# EAGLE schematic EtherTenR3 (EAGLE 6.2)
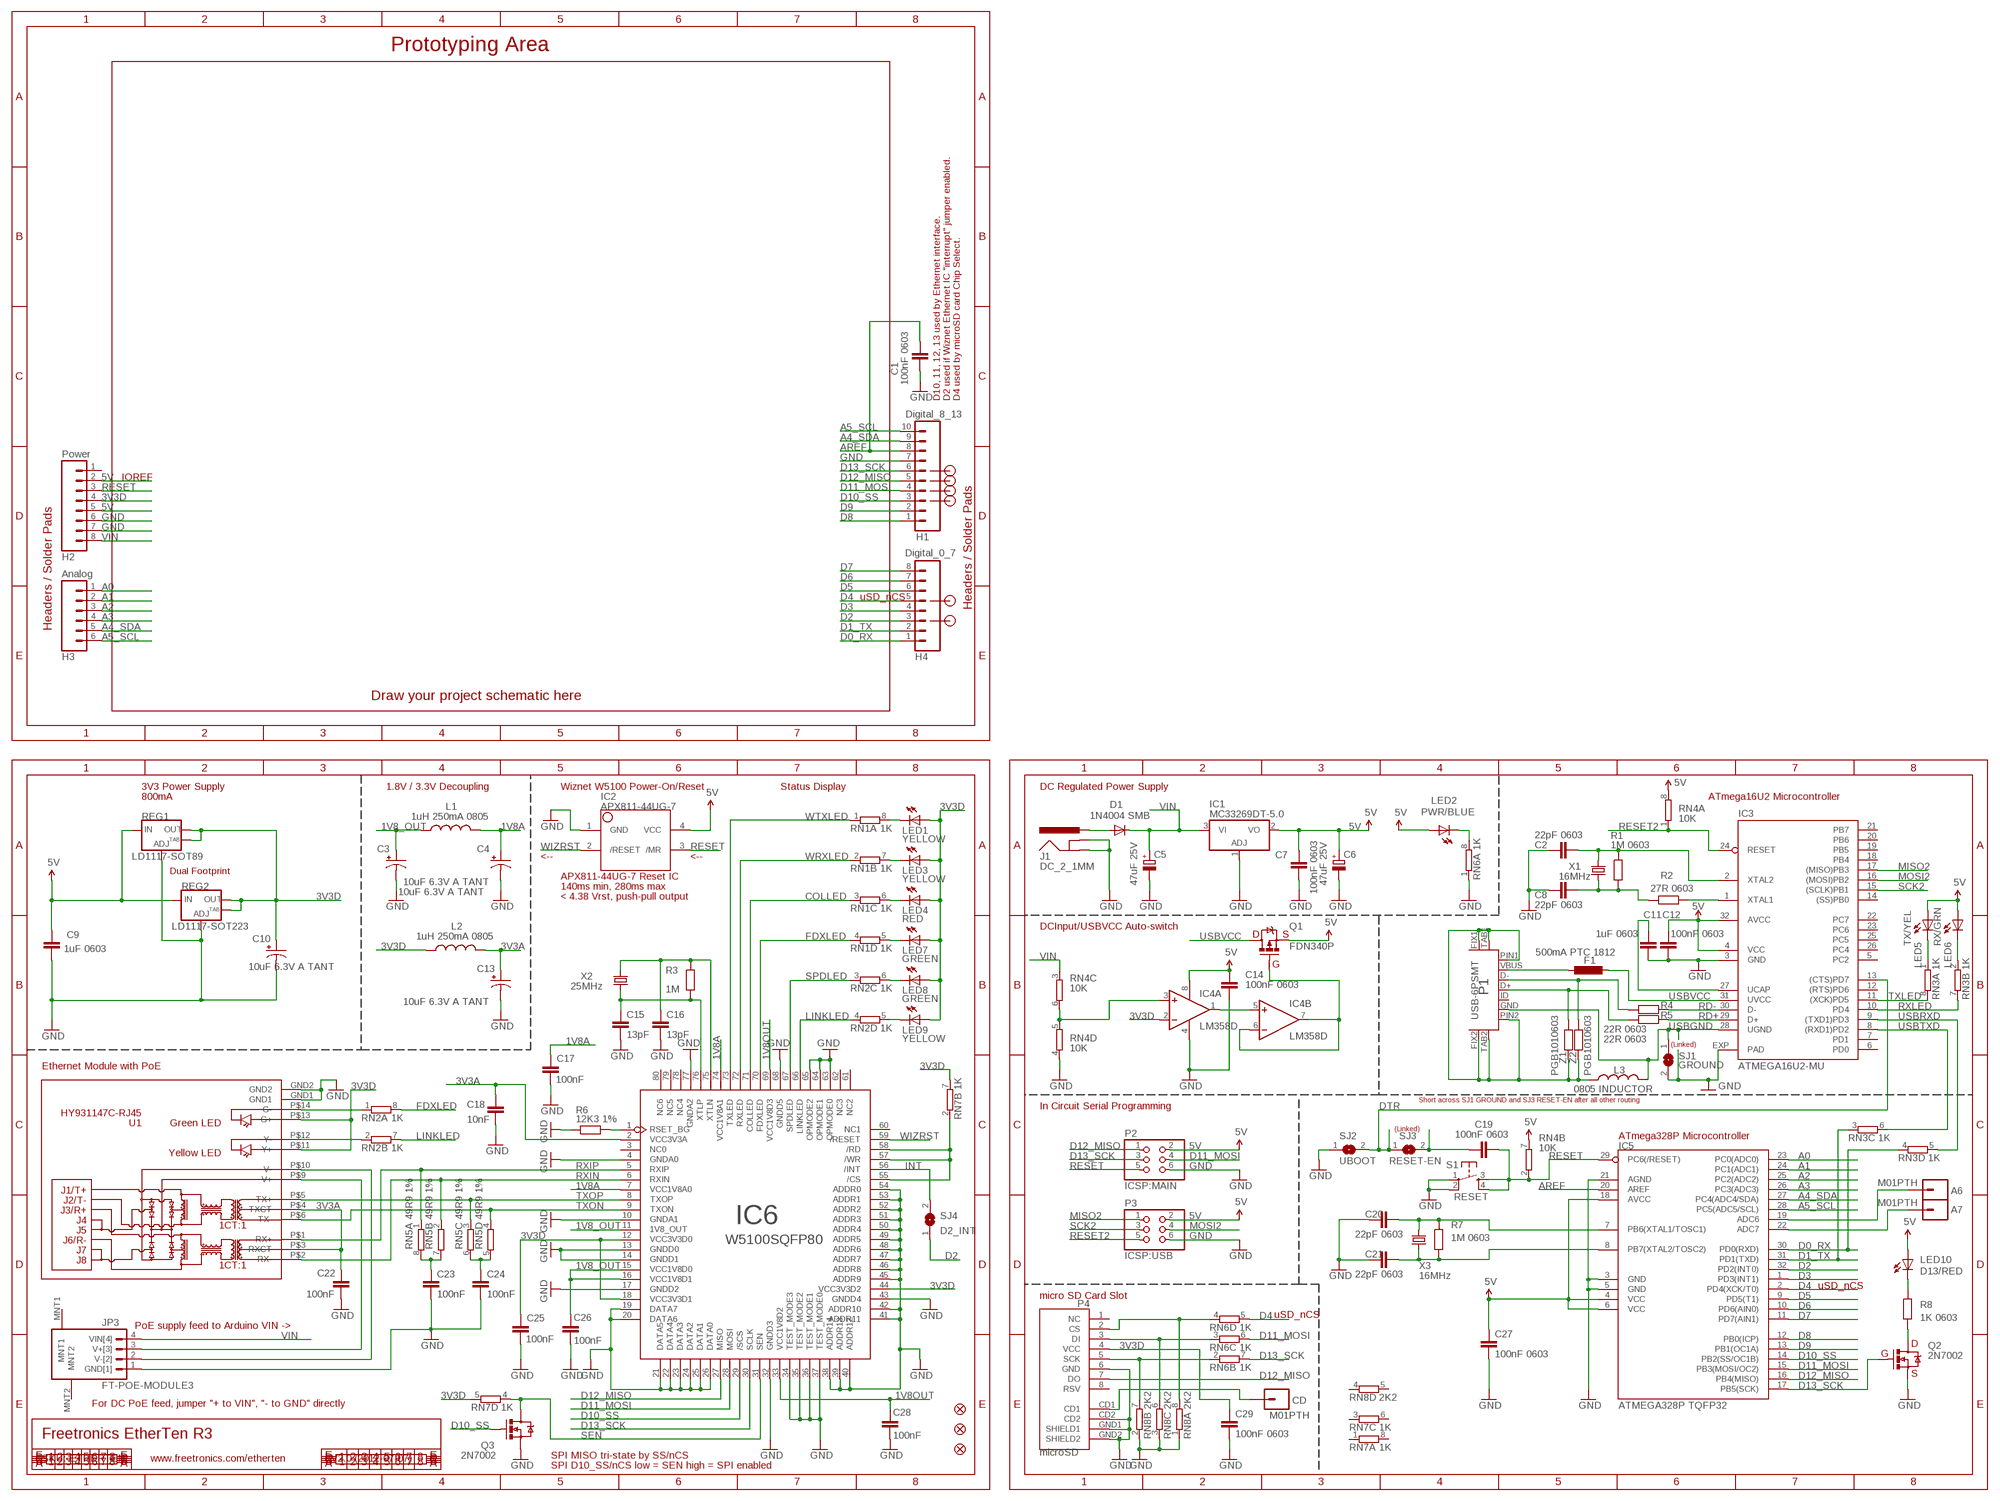
[diagram p0: schematic, sheet 1]

## Parts
A6  M01PTH  [1X01]
A7  M01PTH  [1X01]
C1  100nF 0603  CAP0603  [0603]
C2  22pF 0603  CAP0603  [0603]
C3  10uF 6.3V A TANT  CAP_POL1206  [EIA3216]
C4  10uF 6.3V A TANT  CAP_POL1206  [EIA3216]
C5  47uF 25V  CPOL-EUD  [PANASONIC_D]
C6  47uF 25V  CPOL-EUD  [PANASONIC_D]
C7  100nF 0603  CAP0603  [0603]
C8  22pF 0603  CAP0603  [0603]
C9  1uF 0603  CAP0603  [0603]
C10  10uF 6.3V A TANT  CAP_POL1206  [EIA3216]
C11  1uF 0603  CAP0603  [0603]
C12  100nF 0603  CAP0603  [0603]
C13  10uF 6.3V A TANT  CAP_POL1206  [EIA3216]
C14  100nF 0603  CAP0603  [0603]
C15  13pF  CAP0603  [0603]
C16  13pF  CAP0603  [0603]
C17  100nF  CAP0603  [0603]
C18  10nF  CAP0603  [0603]
C19  100nF 0603  CAP0603  [0603]
C20  22pF 0603  CAP0603  [0603]
C21  22pF 0603  CAP0603  [0603]
C22  100nF  CAP0603  [0603]
C23  100nF  CAP0603  [0603]
C24  100nF  CAP0603  [0603]
C25  100nF  CAP0603  [0603]
C26  100nF  CAP0603  [0603]
C27  100nF 0603  CAP0603  [0603]
C28  100nF  CAP0603  [0603]
C29  100nF 0603  CAP0603  [0603]
CD  M01PTH  [1X01]
D1  1N4004 SMB  DIODESMB  [SMB-DIODE]
F1  500mA PTC 1812  L-EUL1812  [L1812]
FID1  FIDUCIAL1X2.5  [FIDUCIAL-1X2.5]
FID2  FIDUCIAL1X2.5  [FIDUCIAL-1X2.5]
FID3  FIDUCIAL1X2.5  [FIDUCIAL-1X2.5]
H1  Digital_8_13  M100.1  [1X10]
H2  Power  M08  [1X08]
H3  Analog  M06SIP  [1X06]
H4  Digital_0_7  M08  [1X08]
IC1  MC33269DT-5.0  MC33269D-5.0  [DPACK]
IC2  APX811-44UG-7  APX81X-RESET-IC  [SOT143-R]
IC3  ATMEGA16U2-MU  ATMEL_ATMEGA8U2-MUQFN  [ATMEL_QFN32]
IC4  LM358D  [SO08]
IC5  ATMEGA328P TQFP32  AVR-MEGA8-AI  [TQFP32-08]
IC6  W5100SQFP80  [SQFP80]
J1  DC_2_1MM  POWER_JACKPTH  [POWER_JACK_PTH]
JP3  FT-POE-MODULE3  [FT-POE-MODULE-NOLABEL]
L1  1uH 250mA 0805  L-USL2012C  [L2012C]
L2  1uH 250mA 0805  L-USL2012C  [L2012C]
L3  0805 INDUCTOR  INDUCTOR0805-LARGE  [0805-LARGE]
LED1  YELLOW  LED0603  [LED-0603]
LED2  PWR/BLUE  LED0603  [LED-0603]
LED3  YELLOW  LED0603  [LED-0603]
LED4  RED  LED0603  [LED-0603]
LED5  TX/YEL  LED0603  [LED-0603]
LED6  RX/GRN  LED0603  [LED-0603]
LED7  GREEN  LED0603  [LED-0603]
LED8  GREEN  LED0603  [LED-0603]
LED9  YELLOW  LED0603  [LED-0603]
LED10  D13/RED  LED0603  [LED-0603]
P1  USB-6PSMT  [USB-MICROB-MB05PMXX]
P2  ICSP:MAIN  PINHD-2X3  [2X03]
P3  ICSP:USB  PINHD-2X3  [2X03]
P4  microSD  USD-SOCKETNEW  [MICRO-SD-SOCKET-PP]
Q1  FDN340P  MOSFET-PCHANNEL  [SOT23]
Q2  2N7002  MOSFET-NCHANNELSMD  [SOT23-3]
Q3  2N7002  MOSFET-NCHANNELSMD  [SOT23-3]
R1  1M 0603  RESISTOR0603  [0603]
R2  27R 0603  RESISTOR0603  [0603]
R3  1M  RESISTOR0603  [0603]
R4  22R 0603  RESISTOR0603  [0603]
R5  22R 0603  RESISTOR0603  [0603]
R6  12K3 1%  RESISTOR0603  [0603]
R7  1M 0603  RESISTOR0603  [0603]
R8  1K 0603  RESISTOR0603  [0603]
REG1  LD1117-SOT89  V_REG_LM1117SOT89  [SOT89]
REG2  LD1117-SOT223  V_REG_LM1117SOT223  [SOT223]
RN1  1K  4R-NCAY16  [CAY16]
RN2  1K  4R-NCAY16  [CAY16]
RN3  1K  4R-NCAY16  [CAY16]
RN4  10K  4R-NCAY16  [CAY16]
RN5  49R9 1%  4R-NCAY16  [CAY16]
RN6  1K  4R-NCAY16  [CAY16]
RN7  1K  4R-NCAY16  [CAY16]
RN8  2K2  4R-NCAY16  [CAY16]
S1  RESET  TAC_SWITCHSMD  [TACTILE_SWITCH_SMD]
SJ1  GROUND  SJ  [SJ]
SJ2  UBOOT  SJ  [SJ]
SJ3  RESET-EN  SJ  [SJ]
SJ4  D2_INT  SJ  [SJ]
U1  HY931147C-RJ45  [HY931147C]
X1  16MHz  CRYSTALHC49UV  [HC49U-V]
X2  25MHz  CRYSTALHC49UV  [HC49U-V]
X3  16MHz  CRYSTALHC49UV  [HC49U-V]
Z1  PGB1010603  RESISTOR0603  [0603]
Z2  PGB1010603  RESISTOR0603  [0603]

## Nets
1V8_OUT: C3.A(+) C26.1 IC6.11(1V8_OUT) IC6.15(VCC1V8D0) IC6.16(VCC1V8D1) L1.1
1V8A: C4.A(+) C17.1 IC6.7(VCC1V8A0) IC6.74(VCC1V8A1) L1.2
1V8OUT: C28.1 IC6.33(VCC1V8D2) IC6.69(VCC1V8D3)
3V3A: C13.A(+) C18.1 C22.1 IC6.2(VCC3V3A) L2.2 U1.P$3(RXCT) U1.P$4(TXCT)
3V3D: C10.A(+) C25.1 C29.1 H2.4 IC4.2(A:-IN) IC6.12(VCC3V3D0) IC6.18(VCC3V3D1) IC6.44(VCC3V3D2) L2.1 LED1.A LED3.A LED4.A LED7.A LED8.A LED9.A P4.4(VCC) REG1.2(OUT) REG1.4(OUT) REG2.2(OUT) REG2.4(OUT) RN7.5 RN7.7 U1.P$11(Y+) U1.P$13(G+)
5V [power]: C6.+ C7.1 C9.1 C12.1 C14.1 C27.1 H2.2 H2.5 IC1.2(VO) IC2.4(VCC) IC3.4(VCC) IC3.32(AVCC) IC4.8(P:V+) IC5.4(VCC) IC5.6(VCC) IC5.18(AVCC) LED2.A LED5.A LED6.A LED10.A P2.2 P3.2 Q1.2(S) REG1.3(IN) REG2.3(IN) RN4.7 RN4.8
A0: H3.1 IC5.23(PC0(ADC0))
A1: H3.2 IC5.24(PC1(ADC1))
A2: H3.3 IC5.25(PC2(ADC2))
A3: H3.4 IC5.26(PC3(ADC3))
A4_SDA: H1.9 H3.5 IC5.27(PC4(ADC4/SDA))
A5_SCL: H1.10 H3.6 IC5.28(PC5(ADC5/SCL))
AREF: C1.1 H1.8 IC5.20(AREF)
COLLED: IC6.71(COLLED) RN1.3
D0_RX: H4.1 IC5.30(PD0(RXD)) RN3.4
D1_TX: H4.2 IC5.31(PD1(TXD)) RN3.3
D2: H4.3 IC5.32(PD2(INT0)) SJ4.1
D3: H4.4 IC5.1(PD3(INT1))
D4: H4.5 IC5.2(PD4(XCK/T0)) RN6.5
D5: H4.6 IC5.9(PD5(T1))
D6: H4.7 IC5.10(PD6(AIN0))
D7: H4.8 IC5.11(PD7(AIN1))
D8: H1.1 IC5.12(PB0(ICP))
D9: H1.2 IC5.13(PB1(OC1A))
D10_SS: H1.3 IC5.14(PB2(SS/OC1B)) IC6.29(/SCS) Q3.1(G)
D11_MOSI: H1.4 IC5.15(PB3(MOSI/OC2)) IC6.28(MOSI) P2.4 RN6.6
D12_MISO: H1.5 IC5.16(PB4(MISO)) IC6.27(MISO) P2.1 P4.7(DO)
D13_SCK: H1.6 IC5.17(PB5(SCK)) IC6.30(SCLK) P2.3 Q2.1(G) RN6.7
DTR: IC3.13((CTS)PD7) SJ2.2 SJ3.1
FDXLED: IC6.70(FDXLED) RN1.4 RN2.8
GND: C1.2 C2.1 C3.C(-) C4.C(-) C5.- C6.- C7.2 C8.1 C9.2 C10.C(-) C11.2 C12.2 C13.C(-) C14.2 C15.2 C16.2 C17.2 C18.2 C20.1 C21.1 C22.2 C23.2 C24.2 C25.2 C26.2 C27.2 C28.2 C29.2 H1.7 H2.6 H2.7 IC1.1(ADJ) IC2.1(GND) IC3.3(GND) IC3.EXP(PAD) IC4.4(P:V-) IC5.3(GND) IC5.5(GND) IC5.21(AGND) IC6.4(GNDA0) IC6.10(GNDA1) IC6.13(GNDD0) IC6.14(GNDD1) IC6.17(GNDD2) IC6.19(DATA7) IC6.20(DATA6) IC6.21(DATA5) IC6.22(DATA4) IC6.23(DATA3) IC6.24(DATA2) IC6.25(DATA1) IC6.26(DATA0) IC6.32(GNDD3) IC6.34(TEST_MODE3) IC6.35(TEST_MODE2) IC6.36(TEST_MODE1) IC6.37(TEST_MODE0) IC6.38(ADDR14) IC6.39(ADDR13) IC6.40(ADDR12) IC6.41(ADDR11) IC6.42(ADDR10) IC6.43(GNDD4) IC6.45(ADDR9) IC6.46(ADDR8) IC6.47(ADDR7) IC6.48(ADDR6) IC6.49(ADDR5) IC6.50(ADDR4) IC6.51(ADDR3) IC6.52(ADDR2) IC6.53(ADDR1) IC6.54(ADDR0) IC6.63(OPMODE0) IC6.64(OPMODE1) IC6.65(OPMODE2) IC6.68(GNDD5) IC6.77(GNDA2) J1.GND J1.GNDBREAK JP3.1(GND[1]) P2.6 P3.6 P4.6(GND) P4.CD2 P4.GND1(SHIELD1) P4.GND2(SHIELD2) Q2.2(S) Q3.2(S) R6.1 REG1.1(ADJ) REG2.1(ADJ) RN4.4 RN6.1 RN8.1 RN8.2 RN8.3 S1.1 S1.2 SJ1.2 SJ2.1 U1.GND1 U1.GND2
INT: IC6.56(/INT) SJ4.2
LINKLED: IC6.66(LINKLED) RN2.4 RN2.7
MISO2: IC3.17((MISO)PB3) P3.1
MOSI2: IC3.16((MOSI)PB2) P3.4
N$1: C24.1 RN5.5 RN5.6
N$2: C20.2 IC5.7(PB6(XTAL1/TOSC1)) R7.2 X3.2
N$3: C19.1 SJ3.2
N$4: LED10.C R8.2
N$6: Q2.3(D) R8.1
N$7: C21.2 IC5.8(PB7(XTAL2/TOSC2)) R7.1 X3.1
N$8: IC3.1(XTAL1) R2.1
N$9: L3.1 P1.FIX1 P1.FIX2 P1.PIN1 P1.PIN2 P1.TAB1 P1.TAB2 Z1.2 Z2.2
N$11: LED6.C RN3.2
N$12: IC4.3(A:+IN) RN4.5 RN4.6
N$13: LED5.C RN3.1
N$14: LED2.C RN6.8
N$16: P1.D+ R5.2 Z1.1
N$17: P1.D- R4.2 Z2.1
N$18: IC4.6(B:-IN) IC4.7(B:OUT) Q1.1(G)
N$19: IC4.1(A:OUT) IC4.5(B:+IN)
N$20: P4.2(CS) RN6.4 RN8.8
N$21: A7.1 IC5.22(ADC7)
N$22: A6.1 IC5.19(ADC6)
N$23: CD.1 P4.CD1
N$24: P4.5(SCK) RN6.2 RN8.7
N$25: P4.3(DI) RN6.3 RN8.6
N$26: LED8.C RN2.6
N$27: IC6.55(/CS) IC6.57(/WR) IC6.58(/RD) RN7.2
N$28: LED9.C RN2.5
N$60: D1.A J1.PWR
N$67: RN2.1 U1.P$14(G-)
N$68: JP3.3(V+[3]) U1.P$9(V+)
N$69: JP3.2(V-[2]) U1.P$10(V-)
N$113: C2.2 IC3.2(XTAL2) R1.2 X1.2
N$114: C8.2 R1.1 R2.2 X1.1
N$115: F1.1 P1.VBUS
N$117: C11.1 IC3.27(UCAP)
N$321: C23.1 RN5.7 RN5.8
N$322: IC6.1(RSET_BG) R6.2
N$327: LED7.C RN1.5
N$328: LED4.C RN1.6
N$329: LED3.C RN1.7
N$330: LED1.C RN1.8
N$332: RN2.2 U1.P$12(Y-)
RD+: IC3.29(D+) R5.1
RD-: IC3.30(D-) R4.1
RESET: C19.2 H2.3 IC2.3(/MR) IC5.29(PC6(/RESET)) P2.5 RN4.2 S1.3 S1.4
RESET2: IC3.24(RESET) P3.5 RN4.1
RXIN: IC6.6(RXIN) RN5.2 U1.P$2(RX-)
RXIP: IC6.5(RXIP) RN5.1 U1.P$1(RX+)
RXLED: IC3.10(PD4) RN3.7
SCK2: IC3.15((SCLK)PB1) P3.3
SEN: IC6.31(SEN) Q3.3(D) RN7.4
SPDLED: IC6.67(SPDLED) RN2.3
TXLED: IC3.11((XCK)PD5) RN3.8
TXON: IC6.9(TXON) RN5.4 U1.P$6(TX-)
TXOP: IC6.8(TXOP) RN5.3 U1.P$5(TX+)
USBGND: IC3.28(UGND) L3.2 P1.GND SJ1.1
USBRXD: IC3.9((TXD1)PD3) RN3.5
USBTXD: IC3.8((RXD1)PD2) RN3.6
USBVCC: F1.2 IC3.31(UVCC) Q1.3(D)
VIN: C5.+ D1.C H2.8 IC1.3(VI) JP3.4(VIN[4]) RN4.3
WIZRST: IC2.2(/RESET) IC6.59(/RESET)
WRXLED: IC6.72(RXLED) RN1.2
WTXLED: IC6.73(TXLED) RN1.1
XTLN: C16.1 IC6.75(XTLN) R3.2 X2.2
XTLP: C15.1 IC6.76(XTLP) R3.1 X2.1
Unconnected: H2.1 IC3.5(PC2) IC3.6(PD0) IC3.7(PD1) IC3.12((RTS)PD6) IC3.14((SS)PB0) IC3.18(PB4) IC3.19(PB5) IC3.20(PB6) IC3.21(PB7) IC3.22(PC7) IC3.23(PC6) IC3.25(PC5) IC3.26(PC4) IC6.3(NC0) IC6.60(NC1) IC6.61(NC2) IC6.62(NC3) IC6.78(NC4) IC6.79(NC5) IC6.80(NC6) JP3.MNT1 JP3.MNT2 P1.ID P4.1(NC) P4.8(RSV) RN7.1 RN7.3 RN7.6 RN7.8 RN8.4 RN8.5

## Notes on the sheet
- Prototyping Area
- D10, 11, 12, 13 used by Ethernet interface. | D2 used if Wiznet Ethernet IC "interrupt" jumper enabled. | D4 used by microSD card Chip Select.
- IOREF
- uSD_nCS
- Headers / Solder Pads
- Headers / Solder Pads
- Draw your project schematic here
- 3V3 Power Supply | 1.8V / 3.3V Decoupling | Wiznet W5100 Power-On/Reset | Status Display | DC Regulated Power Supply
- 800mA | ATmega16U2 Microcontroller
- <-- | <--
- Dual Footprint
- APX811-44UG-7 Reset IC
- 140ms min, 280ms max
- < 4.38 Vrst, push-pull output
- DCInput/USBVCC Auto-switch
- D | S
- G
- (Linked)
- Ethernet Module with PoE
- Short across SJ1 GROUND and SJ3 RESET-EN after all other routing
- In Circuit Serial Programming
- (Linked)
- ATmega328P Microcontroller
- uSD_nCS
- micro SD Card Slot
- uSD_nCS
- PoE supply feed to Arduino VIN ->
- D
- G
- S
- For DC PoE feed, jumper "+ to VIN", "- to GND" directly
- Freetronics EtherTen R3
- SPI MISO tri-state by SS/nCS
- SKU: ETHERTEN | www.freetronics.com/etherten | V2.0 (2012-07-07)
- SPI D10_SS/nCS low = SEN high = SPI enabled

## Library data of the parts
A6 A7 CD = freetronics-2:M01: Header 1 Standard 1-pin 0.1" header. Use with straight break away headers (SKU : PRT-00116), right angle break away headers (PRT-00553), swiss pins (PRT-00743), machine pins (PRT-00117), and female headers (PRT-00115).
C1 C2 C7-C9 C11 C12 C14-C29 = freetronics:CAP: Capacitor Standard 0603 ceramic capacitor, and 0.1" leaded capacitor.
C3 C4 C10 C13 = freetronics:CAP_POL: Capacitor Polarized These are standard SMD and PTH capacitors. Normally 10uF, 47uF, and 100uF in electrolytic and tantalum varieties. Always verify the external diameter of the through hole cap, it varies with capacity, voltage, and manufacturer. The EIA devices should be standard.
C5 C6 = rcl:CPOL-EU: POLARIZED CAPACITOR, European symbol
D1 = freetronics:DIODE: Diode These are standard reverse protection diodes and small signal diodes. SMA package can handle up to about 1A. SOD-323 can handle about 200mA. What the SOD-323 package when ordering, there are some mfgs out there that are 5-pin packages.
F1 = rcl:L-EU: INDUCTOR, European symbol
FID1-FID3 = freetronics:FIDUCIAL: Fiducial Alignment Points Various fiducial points for machine vision alignment.
H1 = freetronics-original:M10: Header 10 Standard 10-pin 0.1" header. Use with straight break away headers (SKU : PRT-00116), right angle break away headers (PRT-00553), swiss pins (PRT-00743), machine pins (PRT-00117), and female headers (PRT-00115).
H2 = freetronics-master-v1:M08: Header 8 Standard 8-pin 0.1" header. Use with straight break away headers (SKU : PRT-00116), right angle break away headers (PRT-00553), swiss pins (PRT-00743), machine pins (PRT-00117), and female headers (PRT-00115).
H3 = freetronics:M06: Header 6 Standard 6-pin 0.1" header. Use with straight break away headers (SKU : PRT-00116), right angle break away headers (PRT-00553), swiss pins (PRT-00743), machine pins (PRT-00117), and female headers (PRT-00115). Molex polarized connector foot print use with SKU : PRT-08094 with associated crimp pins and housings. NOTES ON THE VARIANTS LOCK and LOCK_LONGPADS... This footprint was designed to help hold the alignment of a through-hole component (i.e. 6-pin header) while soldering it into place. You may notice that each hole has been shifted either up or down by 0.005 of an inch from it's more standard position (which is a perfectly straight line). This slight alteration caused the pins (the squares in the middle) to touch the edges of the holes. Because they are alternating, it causes a "brace" to hold the component in place. 0.005 has proven to be the perfect amount of "off-center" position when using our standard breakaway headers. Although looks a little odd when you look at the bare footprint, once you have a header in there, the alteration is very hard to notice. Also, if you push a header all the way into place, it is covered up entirely on the bottom side. This idea of altering the position of holes to aid alignment will be further integrated into the Sparkfun Library for other footprints. It can help hold any component with 3 or more connection pins.
H4 = freetronics:M08: Header 8 Standard 8-pin 0.1" header. Use with straight break away headers (SKU : PRT-00116), right angle break away headers (PRT-00553), swiss pins (PRT-00743), machine pins (PRT-00117), and female headers (PRT-00115).
IC1 = linear:MC33269?*: Adjustable Output Low Dropout Voltage Regulator 800 mA Source: http://www.onsemi.com/pub/Collateral/MC33269-D.PDF
IC2 = freetronics-master-v1:APX81X-RESET-IC
IC3 = freetronics-jon:ATMEL_ATMEGA8U2-MU
IC4 = linear:LM358: OP AMP also LM158; LM258; LM2904 Source: http://cache.national.com/ds/LM/LM158.pdf
IC5 = freetronics-2:AVR-MEGA8: MICROCONTROLLER 8 Kbytes FLASH 1 kbytes SRAM 512 bytes EEPROM USART 6-channel 10 bit ADC 2-channel 8 bit ADC
IC6 = freetronics-marc:W5100: WIZnet W5100
J1 = freetronics:POWER_JACK: Power Jack This is the standard 5.5mm barrel jack for power. The PTH is the most common, proven, reliable, footprint. All others are experimental. The Slot footprint only works if the mill layer is transmitted to the PCB fab house so be warned. Spark Fun Electronics SKU : PRT-00119. Mating wall wart : TOL-00298 (and others)
JP3 = freetronics-master-v1.1:FT-POE-MODULE
L1 L2 = rcl:L-US: INDUCTOR, American symbol
L3 = freetronics-master-v1:INDUCTOR: Inductors Basic Inductor/Choke - 0603 and 1206. Footprints are not proven and vary greatly between part numbers.
LED1-LED10 = freetronics:LED: LEDs Standard schematic elements and footprints for 5mm, 3mm, 1206, and 0603 sized LEDs. 5mm - Spark Fun Electronics SKU : COM-00529 (and others)
P1 = freetronics-jon:USB-6P
P2 P3 = pinhead:PINHD-2X3: PIN HEADER
P4 = freetronics-master-v1:USD-SOCKET: microSD Socket Push-push type uSD socket. Schematic element and footprint production proven. Spark Fun Electronics SKU : PRT-00127. tDoc lines correctly indicate media card edge positions when inserting (unlocked, locked, depressed).
Q1 = freetronics-master-v1:MOSFET-PCHANNEL
Q2 Q3 = freetronics:MOSFET-NCHANNEL
R1-R8 Z1 Z2 = freetronics:RESISTOR: Resistor Basic schematic elements and footprints for 0603, 1206, and PTH 1/10th watt (small) resistors.
REG1 REG2 = freetronics:V_REG_LM1117: Voltage Regulator LD1117 Adjustable low-dropout voltage regulator available in SOT89 and SOT223 SMT packages.
RN1-RN8 = freetronics-master-v1:4R-N: Array Chip Resistor Source: RS Component / Phycomp
S1 = freetronics:TAC_SWITCH: Momentary Switch Button commonly used for reset or general input. Spark Fun Electronics SKU : COM-00097
SJ1-SJ4 = jumper:SJ: SMD solder JUMPER
U1 = freetronics-jon:HY931147C
X1-X3 = freetronics-master-v1:CRYSTAL: Crystals Various standard crystals. Proven footprints. Spark Fun Electronics SKU : COM-00534